# EAGLE board draft5_4lyr_autoroute (EAGLE 6.3)
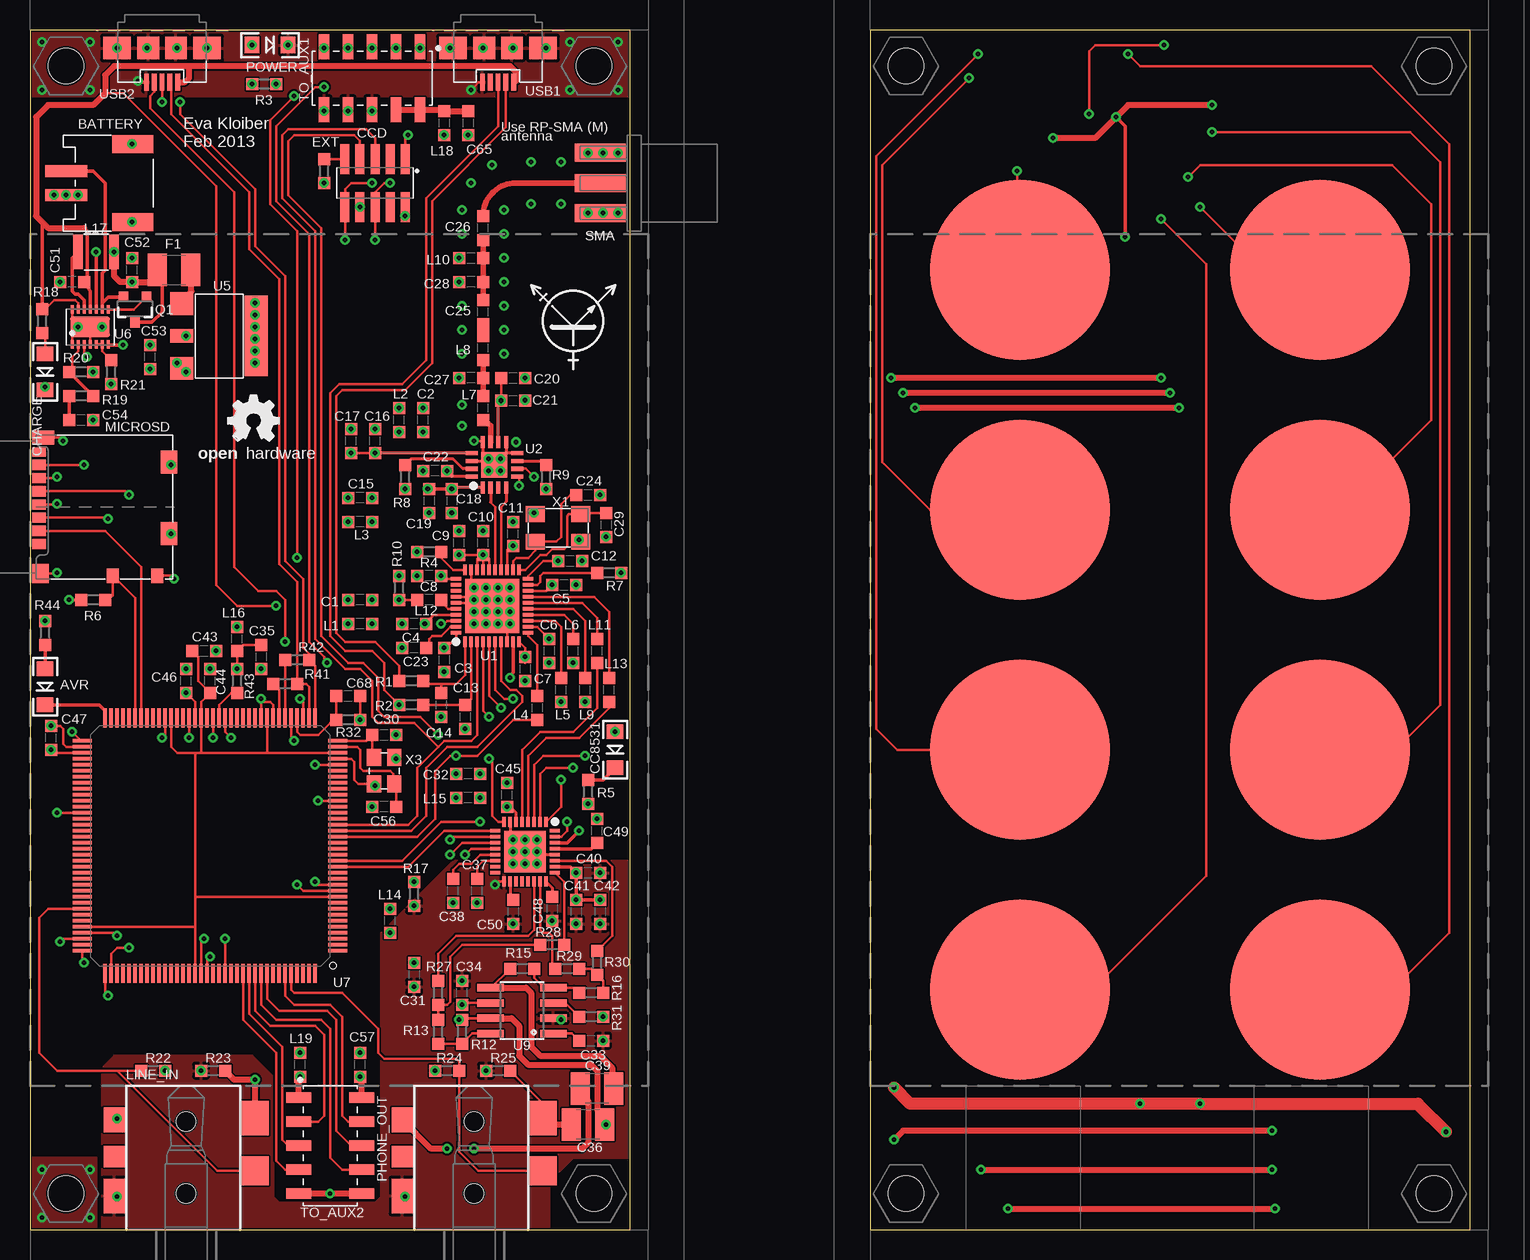
[diagram p2: board, top side]
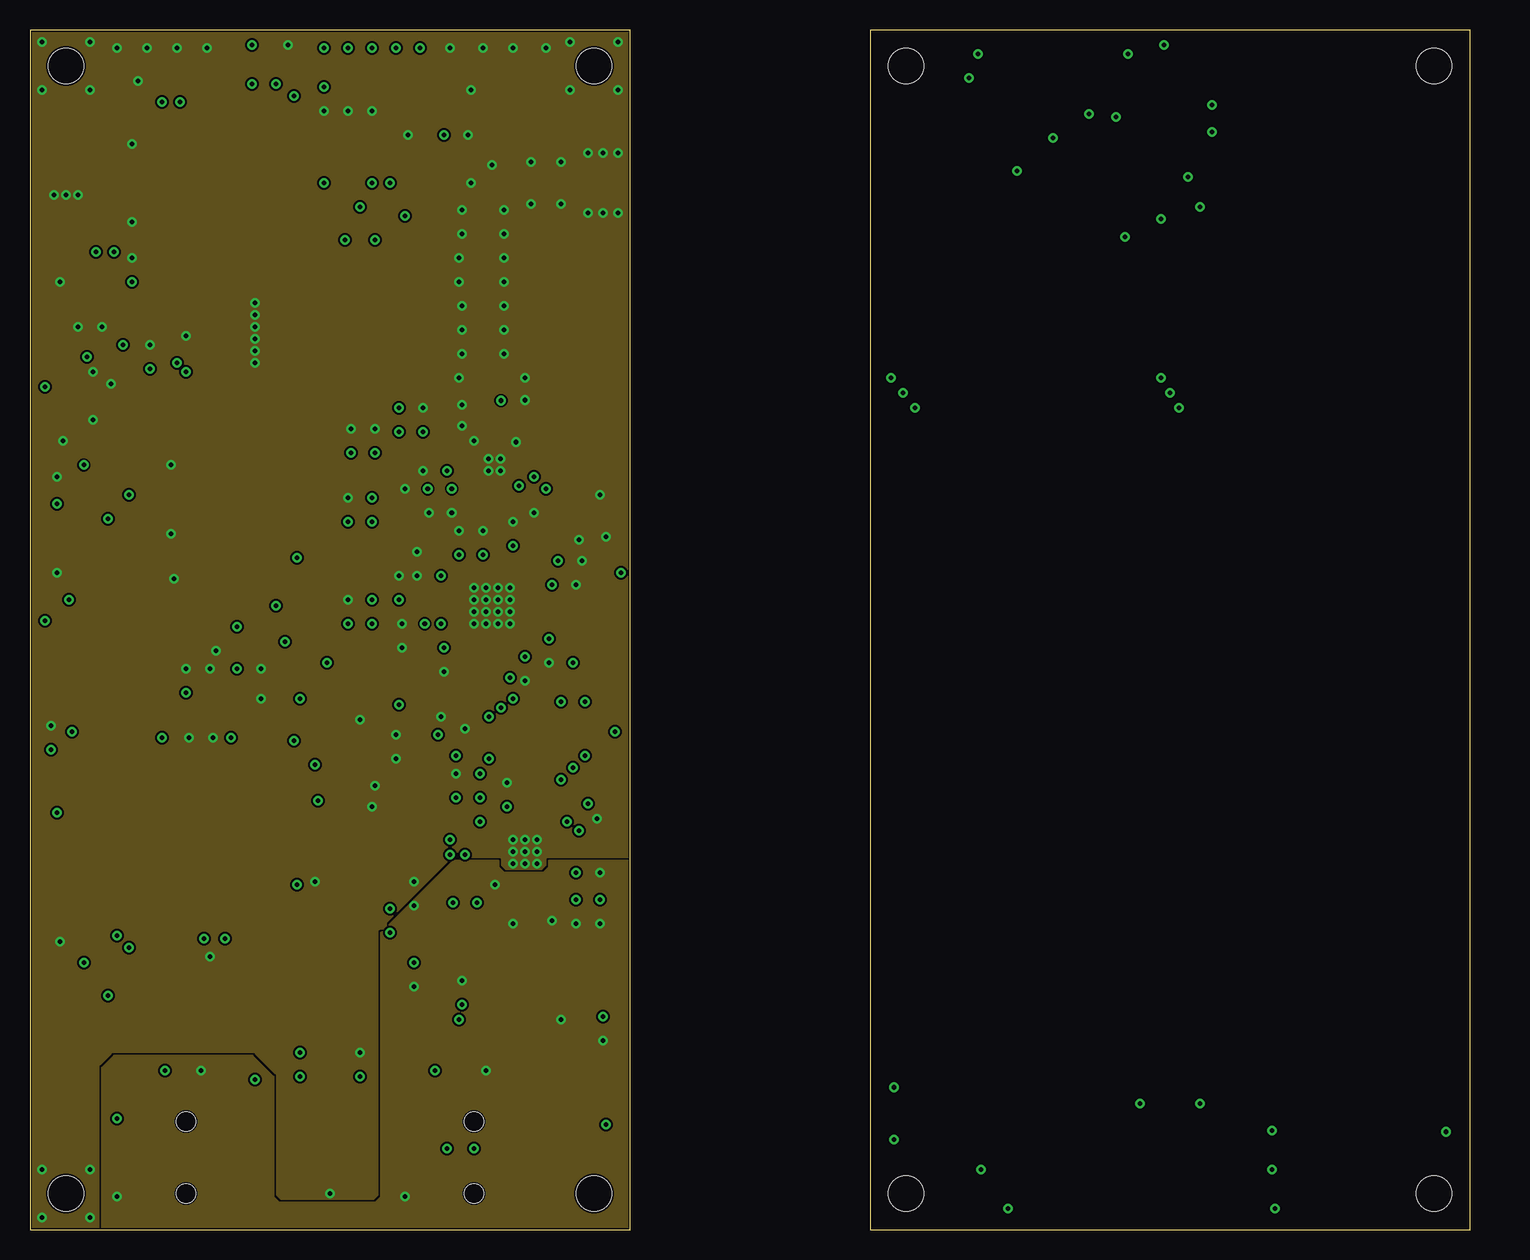
[diagram p3: board, inner layer Route2]
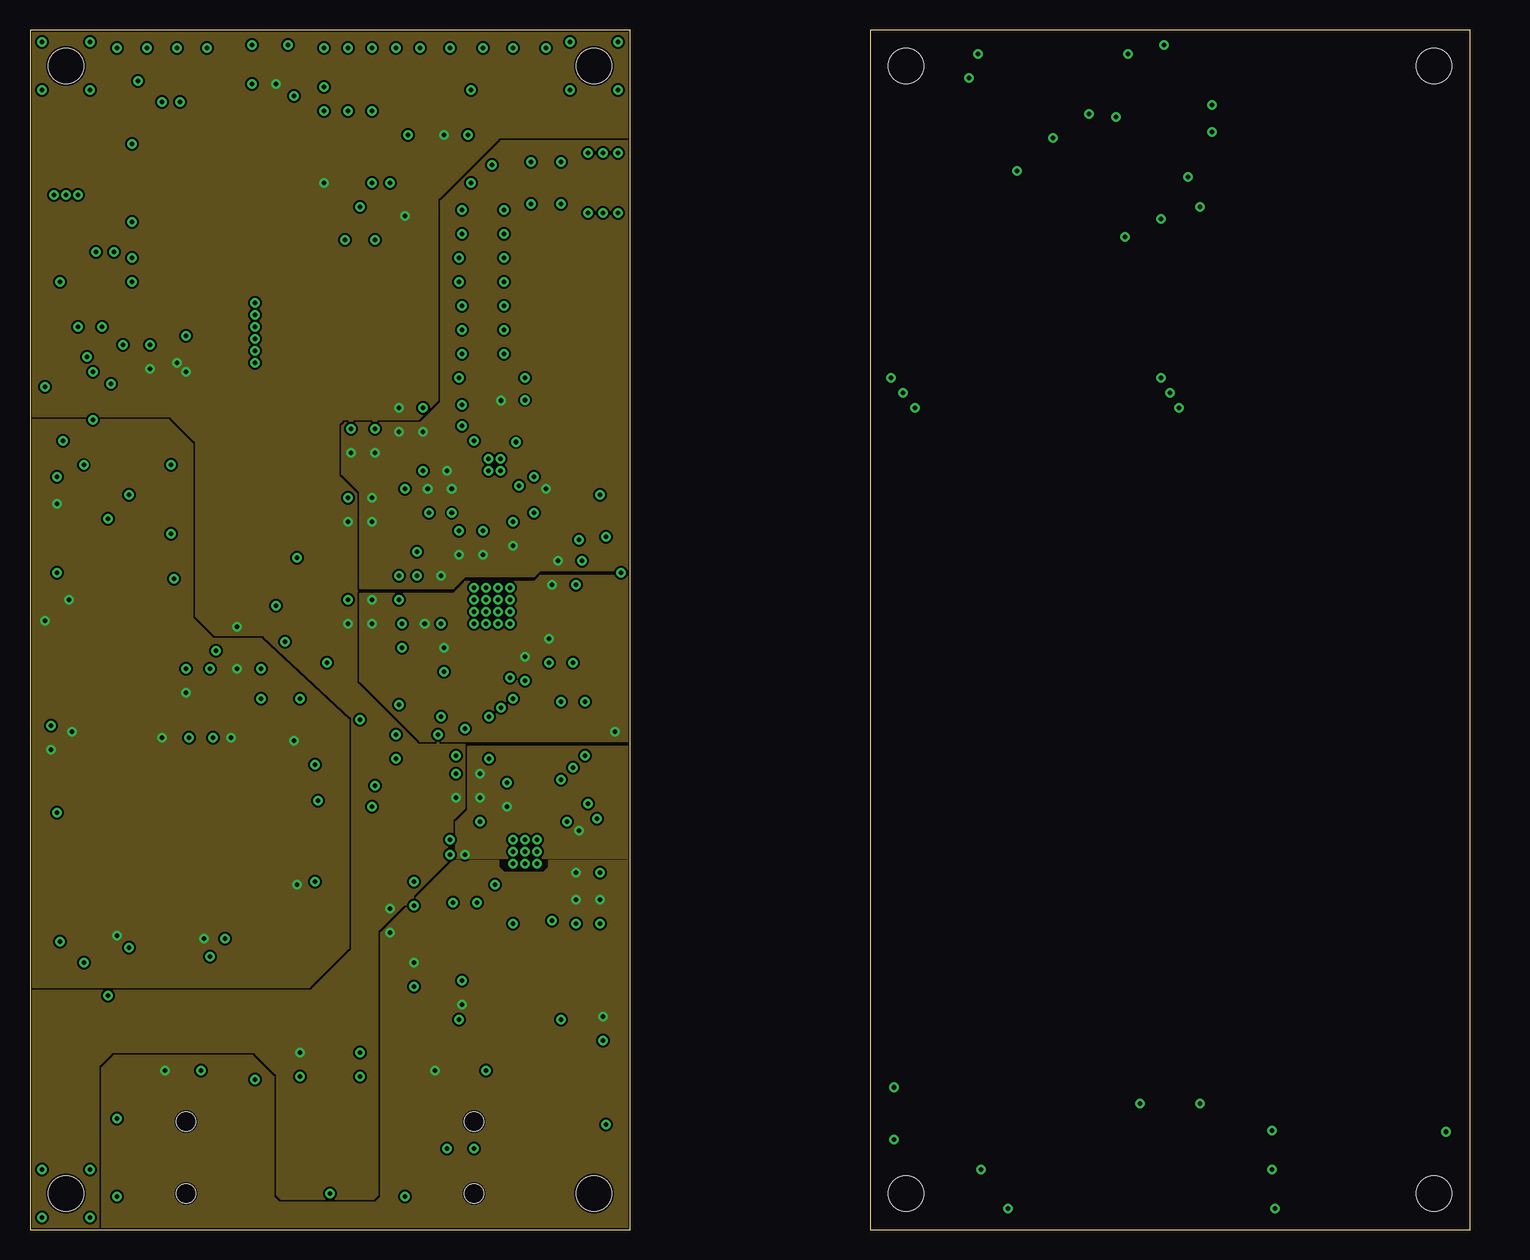
[diagram p4: board, inner layer Route3]
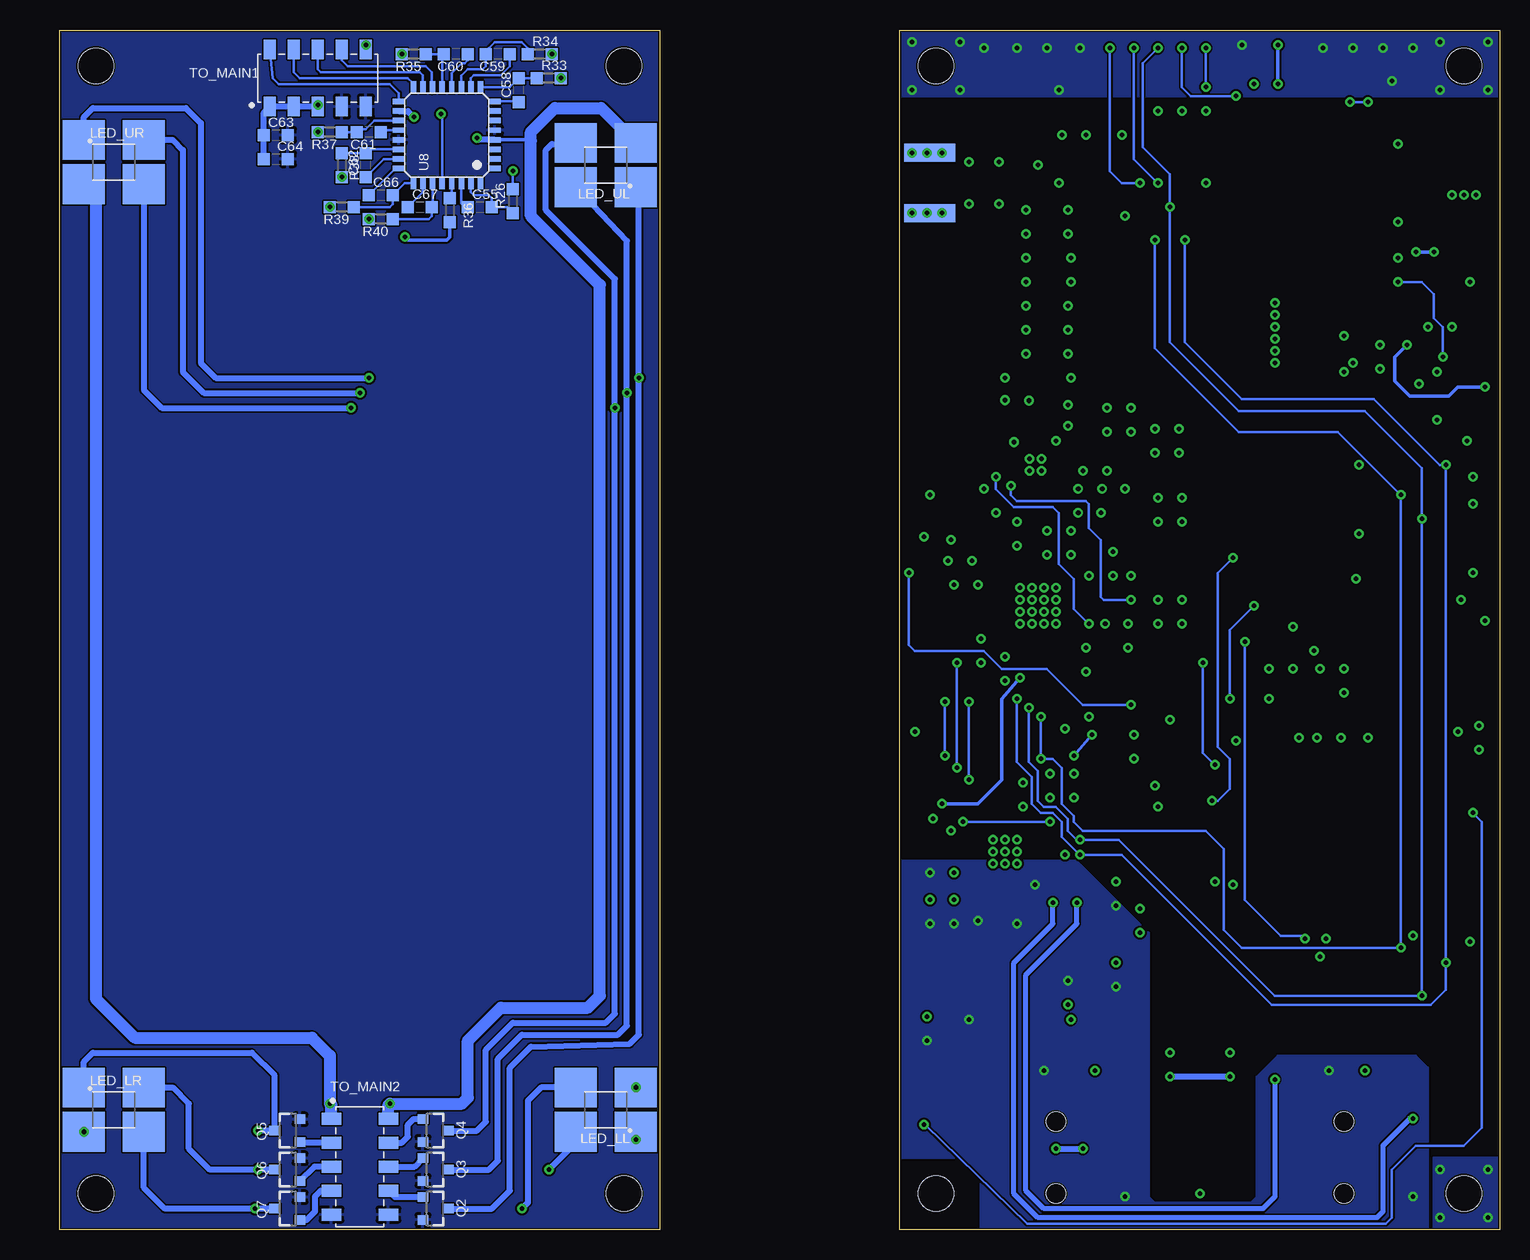
[diagram p5: board, bottom side, seen from below]

Size 120 x 100 mm. Coordinates in mm from the lower left corner, seen from the top.
Outline: 0,0 50,0 50,100 0,100 0,0
Outline: 70,0 120,0 120,100 70,100 70,0
Copper layers (1+2*3+16): Top 0.034290625mm / dielectric 0.24891875mm / Route2 0.034290625mm / dielectric 39mil / Route3 0.034290625mm / dielectric 0.24891875mm / Bottom 0.034290625mm
Design rules "66each": minimum track width 6mil, minimum drill 15mil, track to track 6mil, track to pad 6mil, pad to pad 6mil, via to via 6mil, smd to smd 0mil, copper to edge 6mil, drill to drill 6mil, minimum pad ring 10mil, minimum via ring 8mil, stop-mask expansion 4mil, vias tented up to drill 0mil, thermal gap 10mil
tRestrict: area 38.8,66.5 to 39.5,68.5; area 37.5,66.2 to 38.8,67; area 29.2,64.2 to 36.2,65.2; area 35.5,61.2 to 37.8,62.2; area 38,55 to 40,61.8; area 36.8,66.5 to 50,88.2

## Footprints (pad centres in the part's own frame; a part is rotated, then mirrored left to right if it is on the bottom)
LED-1206 = smd 1.2 x 1.4: A -1.5,0; C 1.5,0
1775469-2 = smd 1 x 3.5: + -1,-1.75; - 1,-1.75 | smd 1.5 x 3.4: X1 -3.25,3.8; X2 3.25,3.8
C0603 = smd 1 x 1: 1 -1,0; 2 1,0
C1210 = smd 1.6 x 2.7: 1 -1.4,0; 2 1.4,0
HEADER-10P-1.27MM = smd 0.75 x 2.5: 1 -2.54,-2; 2 -2.54,2; 3 -1.27,-2; 4 -1.27,2; 5 0,-2; 6 0,2; 7 1.27,-2; 8 1.27,2; 9 2.54,-2; 10 2.54,2
R0603 = smd 1 x 1: 1 -1,0; 2 1,0
1210 = smd 1.6 x 2.7: 1 -1.4,0; 2 1.4,0
0603 = smd 1 x 1: 1 -1,0; 2 1,0
IFSC-1111AB-01 = smd 0.8 x 2.9: 1 -1.5,0; 2 1.5,0
PLCC-4 = smd 1.5 x 1.1: 1 -1.5,0.75; 2 -1.5,-0.75; 3 1.5,-0.75; 4 1.5,0.75 | smd 3.5 x 3.3: 1-2 -2.5,1.85; 2-2 -2.5,-1.85; 3-2 2.5,-1.85; 4-2 2.5,1.85
STX-35332-5N = smd 1.75 x 2.1: 1 -6,9.15 | smd 1.75 x 1.8: 2 -6,6.1 | smd 2.25 x 2.4: 3 5.75,4.9 | smd 2.25 x 2.9: 4 5.75,9.3 | smd 1.75 x 2.9: 5 -6,2.8 | hole 1.6: 0,9; 0,3
MOLEX_104031-0811 = smd 0.85 x 1.1: CD/DAT3 2.005,0.25; CLK -1.295,0.25; CMD 0.905,0.25; DAT0 -3.495,0.25; DAT2 3.105,0.25; VDD -0.195,0.25; VSS -2.395,0.25 | smd 0.75 x 1.1: DAT1 -4.545,0.25 | smd 1.55 x 1.35: GND1 5.565,0.375 | smd 1.17 x 1.8: GND2 -5.755,0.6 | smd 1.9 x 1.35: GND3 -3.73,11.075; GND4 2.24,11.075 | smd 1.2 x 1: SWA 5.74,6.4; SWB 5.74,10.1
SOT23-3 = smd 0.8 x 0.9: 1 -0.95,-1; 2 0.95,-1; 3 0,1.1
CONREVSMA003.062 = smd 4.25 x 1.5 bottom: GND1 2.25,-2.54; GND3 2.25,2.54 | smd 4.25 x 1.5: GND2 2.25,-2.54; GND4 2.25,2.54; SIG 2.25,0
TOUCH-CIRCLE-15MM = smd 15 x 15: P$1 0,0
M22-63405 = smd 0.89 x 2.1: 1 -4,-2.6; 2 -4,2.65; 3 -2,-2.6; 4 -2,2.65; 5 0,-2.6; 6 0,2.65; 7 2,-2.6; 8 2,2.65; 9 4,-2.6; 10 4,2.65
M22-53205 = smd 1 x 1.65: 1 -4,-2.375; 2 -4,2.375; 3 -2,-2.375; 4 -2,2.375; 5 0,-2.375; 6 0,2.375; 7 2,-2.375; 8 2,2.375; 9 4,-2.375; 10 4,2.375
S-PVQFN-N40 = smd 0.85 x 0.28: 1 -3,2.25; 2 -3,1.75; 3 -3,1.25; 4 -3,0.75; 5 -3,0.25; 6 -3,-0.25; 7 -3,-0.75; 8 -3,-1.25; 9 -3,-1.75; 10 -3,-2.25; 21 3,-2.25; 22 3,-1.75; 23 3,-1.25; 24 3,-0.75; 25 3,-0.25; 26 3,0.25; 27 3,0.75; 28 3,1.25; 29 3,1.75; 30 3,2.25 | smd 0.28 x 0.85: 11 -2.25,-3; 12 -1.75,-3; 13 -1.25,-3; 14 -0.75,-3; 15 -0.25,-3; 16 0.25,-3; 17 0.75,-3; 18 1.25,-3; 19 1.75,-3; 20 2.25,-3; 31 2.25,3; 32 1.75,3; 33 1.25,3; 34 0.75,3; 35 0.25,3; 36 -0.25,3; 37 -0.75,3; 38 -1.25,3; 39 -1.75,3; 40 -2.25,3 | smd 4.5 x 4.5: GND 0,0
S-PVQFN-N16 = smd 1 x 0.35: 1 -1.9,0.975; 2 -1.9,0.325; 3 -1.9,-0.325; 4 -1.9,-0.975; 9 1.9,-0.975; 10 1.9,-0.325; 11 1.9,0.325; 12 1.9,0.975 | smd 0.35 x 1: 5 -0.975,-1.9; 6 -0.325,-1.9; 7 0.325,-1.9; 8 0.975,-1.9; 13 0.975,1.9; 14 0.325,1.9; 15 -0.325,1.9; 16 -0.975,1.9 | smd 2.16 x 2.16: GND 0,0
S-PVQFN-N32 = smd 0.85 x 0.28: 1 -2.475,1.75; 2 -2.475,1.25; 3 -2.475,0.75; 4 -2.475,0.25; 5 -2.475,-0.25; 6 -2.475,-0.75; 7 -2.475,-1.25; 8 -2.475,-1.75; 17 2.475,-1.75; 18 2.475,-1.25; 19 2.475,-0.75; 20 2.475,-0.25; 21 2.475,0.25; 22 2.475,0.75; 23 2.475,1.25; 24 2.475,1.75 | smd 0.28 x 0.85: 9 -1.75,-2.475; 10 -1.25,-2.475; 11 -0.75,-2.475; 12 -0.25,-2.475; 13 0.25,-2.475; 14 0.75,-2.475; 15 1.25,-2.475; 16 1.75,-2.475; 25 1.75,2.475; 26 1.25,2.475; 27 0.75,2.475; 28 0.25,2.475; 29 -0.25,2.475; 30 -0.75,2.475; 31 -1.25,2.475; 32 -1.75,2.475 | smd 3.45 x 3.45: GND 0,0
SOT-223 = smd 1.9 x 1.9: 1 -2.7,-3.1; 3 2.7,-3.1 | smd 1.1 x 1.9: 2 0,-3.1 | smd 6.7 x 1.9: 4 0,3.1
DFN-14 = smd 0.25 x 0.7: 1 -1.5,-1.45; 2 -1,-1.45; 3 -0.5,-1.45; 4 0,-1.45; 5 0.5,-1.45; 6 1,-1.45; 7 1.5,-1.45; 8 1.5,1.45; 9 1,1.45; 10 0.5,1.45; 11 0,1.45; 12 -0.5,1.45; 13 -1,1.45; 14 -1.5,1.45 | smd 3.3 x 1.7: GND 0,0
LQFP-144 = smd 1.6 x 0.3: 1 -10.65,8.75; 2 -10.65,8.25; 3 -10.65,7.75; 4 -10.65,7.25; 5 -10.65,6.75; 6 -10.65,6.25; 7 -10.65,5.75; 8 -10.65,5.25; 9 -10.65,4.75; 10 -10.65,4.25; 11 -10.65,3.75; 12 -10.65,3.25; 13 -10.65,2.75; 14 -10.65,2.25; 15 -10.65,1.75; 16 -10.65,1.25; 17 -10.65,0.75; 18 -10.65,0.25; 19 -10.65,-0.25; 20 -10.65,-0.75; 21 -10.65,-1.25; 22 -10.65,-1.75; 23 -10.65,-2.25; 24 -10.65,-2.75; 25 -10.65,-3.25; 26 -10.65,-3.75; 27 -10.65,-4.25; 28 -10.65,-4.75; 29 -10.65,-5.25; 30 -10.65,-5.75; 31 -10.65,-6.25; 32 -10.65,-6.75; 33 -10.65,-7.25; 34 -10.65,-7.75; 35 -10.65,-8.25; 36 -10.65,-8.75; 73 10.65,-8.75; 74 10.65,-8.25; 75 10.65,-7.75; 76 10.65,-7.25; 77 10.65,-6.75; 78 10.65,-6.25; 79 10.65,-5.75; 80 10.65,-5.25; 81 10.65,-4.75; 82 10.65,-4.25; 83 10.65,-3.75; 84 10.65,-3.25; 85 10.65,-2.75; 86 10.65,-2.25; 87 10.65,-1.75; 88 10.65,-1.25; 89 10.65,-0.75; 90 10.65,-0.25; 91 10.65,0.25; 92 10.65,0.75; 93 10.65,1.25; 94 10.65,1.75; 95 10.65,2.25; 96 10.65,2.75; 97 10.65,3.25; 98 10.65,3.75; 99 10.65,4.25; 100 10.65,4.75; 101 10.65,5.25; 102 10.65,5.75; 103 10.65,6.25; 104 10.65,6.75; 105 10.65,7.25; 106 10.65,7.75; 107 10.65,8.25; 108 10.65,8.75 | smd 0.3 x 1.6: 37 -8.75,-10.65; 38 -8.25,-10.65; 39 -7.75,-10.65; 40 -7.25,-10.65; 41 -6.75,-10.65; 42 -6.25,-10.65; 43 -5.75,-10.65; 44 -5.25,-10.65; 45 -4.75,-10.65; 46 -4.25,-10.65; 47 -3.75,-10.65; 48 -3.25,-10.65; 49 -2.75,-10.65; 50 -2.25,-10.65; 51 -1.75,-10.65; 52 -1.25,-10.65; 53 -0.75,-10.65; 54 -0.25,-10.65; 55 0.25,-10.65; 56 0.75,-10.65; 57 1.25,-10.65; 58 1.75,-10.65; 59 2.25,-10.65; 60 2.75,-10.65; 61 3.25,-10.65; 62 3.75,-10.65; 63 4.25,-10.65; 64 4.75,-10.65; 65 5.25,-10.65; 66 5.75,-10.65; 67 6.25,-10.65; 68 6.75,-10.65; 69 7.25,-10.65; 70 7.75,-10.65; 71 8.25,-10.65; 72 8.75,-10.65; 109 8.75,10.65; 110 8.25,10.65; 111 7.75,10.65; 112 7.25,10.65; 113 6.75,10.65; 114 6.25,10.65; 115 5.75,10.65; 116 5.25,10.65; 117 4.75,10.65; 118 4.25,10.65; 119 3.75,10.65; 120 3.25,10.65; 121 2.75,10.65; 122 2.25,10.65; 123 1.75,10.65; 124 1.25,10.65; 125 0.75,10.65; 126 0.25,10.65; 127 -0.25,10.65; 128 -0.75,10.65; 129 -1.25,10.65; 130 -1.75,10.65; 131 -2.25,10.65; 132 -2.75,10.65; 133 -3.25,10.65; 134 -3.75,10.65; 135 -4.25,10.65; 136 -4.75,10.65; 137 -5.25,10.65; 138 -5.75,10.65; 139 -6.25,10.65; 140 -6.75,10.65; 141 -7.25,10.65; 142 -7.75,10.65; 143 -8.25,10.65; 144 -8.75,10.65
S-PQFP-N32 = smd 0.45 x 1: 1 -2.8,-4; 2 -2,-4; 3 -1.2,-4; 4 -0.4,-4; 5 0.4,-4; 6 1.2,-4; 7 2,-4; 8 2.8,-4; 17 2.8,4; 18 2,4; 19 1.2,4; 20 0.4,4; 21 -0.4,4; 22 -1.2,4; 23 -2,4; 24 -2.8,4 | smd 1 x 0.45: 9 4,-2.8; 10 4,-2; 11 4,-1.2; 12 4,-0.4; 13 4,0.4; 14 4,1.2; 15 4,2; 16 4,2.8; 25 -4,2.8; 26 -4,2; 27 -4,1.2; 28 -4,0.4; 29 -4,-0.4; 30 -4,-1.2; 31 -4,-2; 32 -4,-2.8
SO08 = smd 0.61 x 2.21: 1 -1.905,-2.616; 2 -0.635,-2.616; 3 0.635,-2.616; 4 1.905,-2.616; 5 1.905,2.616; 6 0.635,2.616; 7 -0.635,2.616; 8 -1.905,2.616
STANDOFF_3/16 = hole 2.946: 0,0
USB_MICRO_AB = smd 0.4 x 1.4: 1 -1.3,2.85; 2 -0.65,2.85; 3 0,2.85; 4 0.65,2.85; 5 1.3,2.85 | smd 2.3 x 1.9: GND1 -3.75,0; GND4 3.75,0 | smd 1.8 x 1.9: GND2 -1.15,0; GND3 1.15,0
ABM3C = smd 1.6 x 1.3: 1 -1.9,-1.15; 2 1.9,-1.15; 3 1.9,1.15; 4 -1.9,1.15
ABM8G = smd 1.4 x 1.2: GND-1 -1.1,0.85; GND-2 1.1,-0.85; X1 1.1,0.85; X2 -1.1,-0.85

## Placement (x,y rotation side)
AVR  [LED-1206]  1.25,45.25 270 top
BATTERY  BATTERY-LIPO-JST  [1775469-2]  4.75,87.25 270 top
C1  2.2u  [C0603]  27.5,52.5 180 top
C2  2.2u  [C0603]  32.75,67.5 90 top
C3  1u  [C0603]  34.5,47.5 270 top
C4  100n  [C0603]  32,50.5 180 top
C5  100n  [C0603]  44.5,53.75 0 top
C6  100n  [C0603]  43.25,48.25 270 top
C7  100n  [C0603]  41.25,46.75 270 top
C8  100n  [C0603]  33.25,54.5 180 top
C9  100n  [C0603]  35.75,57.25 90 top
C10  220p  [C0603]  37.75,57.25 90 top
C11  100n  [C0603]  40.25,58 90 top
C12  100n  [C0603]  45,55.75 0 top
C13  47p  [C0603]  36.25,42.75 270 top
C14  47p  [C0603]  34.25,43.75 270 top
C15  2.2u  [C0603]  27.5,61 180 top
C16  10p  [C0603]  28.75,65.75 90 top
C17  1n  [C0603]  26.75,65.75 90 top
C18  10p  [C0603]  35.15,60.75 270 top
C19  1n  [C0603]  33.25,60.75 270 top
C20  1n  [C0603]  40.25,71 0 top
C21  18p  [C0603]  40.25,69.1 0 top
C22  1n  [C0603]  33.75,63.25 180 top
C23  1u  [C0603]  32,48.5 180 top
C24  15p  [C0603]  46.5,61.25 0 top
C25  6.8p_HF  [C0603]  37.75,76.5 90 top
C26  100p_HF  [C0603]  37.75,83.5 90 top
C27  1.2p_HF  [C0603]  36.75,71 180 top
C28  1.8p_HF  [C0603]  36.75,79 180 top
C29  15p  [C0603]  48,58.75 270 top
C30  10p  [C0603]  29.5,41.25 0 top
C31  2.2u  [C0603]  32,21.25 270 top
C32  2.2u  [C0603]  36.5,38 180 top
C33  1u  [C0603]  46.75,15.75 0 top
C34  100n  [C0603]  36,19.75 90 top
C35  2.2u  [C0603]  19.25,47.75 270 top
C36  220u  [C1210]  46.5,8.75 180 top
C37  0.47u  [C0603]  37.25,28.25 90 top
C38  0.47u  [C0603]  35.25,28.25 90 top
C39  220u  [C1210]  47.25,11.75 180 top
C40  100n  [C0603]  46.5,29.75 0 top
C41  1u  [C0603]  45.5,26.5 270 top
C42  10u  [C0603]  47.5,26.5 270 top
C43  100n  [C0603]  14.5,48.25 0 top
C44  4.7u  [C0603]  15,45.75 90 top
C45  1u  [C0603]  39.75,36.25 90 top
C46  10u  [C0603]  13,45.75 90 top
C47  100n  [C0603]  1.75,41 90 top
C48  10u  [C0603]  43.5,26.75 270 top
C49  10u  [C0603]  47.25,33.25 90 top
C50  10u  [C0603]  40.25,26.5 270 top
C51  10u  [C0603]  3.5,79 180 top
C52  10u  [C0603]  8.5,80 90 top
C53  10u  [C0603]  10,72.75 90 top
C54  100n  [C0603]  4.25,67.5 0 top
C55  10n  [C0603]  85,85.25 0 bottom
C56  10p  [C0603]  29.5,35.25 180 top
C57  2.2u  [C0603]  27.5,13.75 90 top
C58  10n  [C0603]  81.75,95 90 bottom
C59  10n  [C0603]  83.5,98 180 bottom
C60  10n  [C0603]  87,98 180 bottom
C61  10n  [C0603]  94.25,91.5 180 bottom
C62  10n  [C0603]  94.5,88.75 90 bottom
C63  100n  [C0603]  102,91.25 0 bottom
C64  100n  [C0603]  102,89.25 0 bottom
C65  2.2u  [C0603]  36.5,92.25 270 top
C66  10n  [C0603]  93.25,86.25 0 bottom
C67  10n  [C0603]  90,85.25 0 bottom
C68  10p  [C0603]  26.5,44.5 0 top
CC8531  [LED-1206]  48.75,40 270 top
CCD  HEADER-10P-SMD-MALE2  [HEADER-10P-1.27MM]  28.75,87.25 180 top
CHARGE  [LED-1206]  1.25,71.5 270 top
EXT  0  [R0603]  24.5,88.25 270 top
F1  2A  [1210]  12,80 0 top
L1  BEAD  [0603]  27.5,50.5 180 top
L2  BEAD  [0603]  30.75,67.5 90 top
L3  BEAD  [0603]  27.5,59 180 top
L4  6.8n  [0603]  42.25,43.5 270 top
L5  6.8n  [0603]  44.25,45 90 top
L6  6.8n  [0603]  45.25,48.25 90 top
L7  2.2n_HF  [0603]  37.75,68.5 90 top
L8  3.9n_HF  [0603]  37.75,73.5 90 top
L9  6.8n  [0603]  46.25,45 90 top
L10  1.5n_HF  [0603]  36.75,81 0 top
L11  6.8n  [0603]  47.25,48.25 90 top
L12  6.8n  [0603]  33.25,52.5 180 top
L13  6.8n  [0603]  48.25,45 90 top
L14  BEAD  [0603]  30,25.75 90 top
L15  BEAD  [0603]  36.5,36 180 top
L16  BEAD  [0603]  17.25,49.25 90 top
L17  3.3u  [IFSC-1111AB-01]  5.5,81.5 0 top
L18  BEAD  [0603]  34.5,92.25 270 top
L19  BEAD  [0603]  22.5,13.75 90 top
LED_LL  LED_RGB  [PLCC-4]  74.5,10 180 bottom
LED_LR  LED_RGB  [PLCC-4]  115.5,10 0 bottom
LED_UL  LED_RGB  [PLCC-4]  74.5,88.75 180 bottom
LED_UR  LED_RGB  [PLCC-4]  115.5,89 0 bottom
LINE_IN  PHONE_SW-STX-35332-5N  [STX-35332-5N]  13,0 0 top
MICROSD  MICROSD104031-0811  [MOLEX_104031-0811]  0.5,60.25 270 top
PHONE_OUT  PHONE_SW-STX-35332-5N  [STX-35332-5N]  37,0 0 top
POWER  [LED-1206]  20,98.75 0 top
Q1  Si2333  [SOT23-3]  8.75,76.75 180 top
Q2  2N7002  [SOT23-3]  88.75,1.75 270 bottom
Q3  2N7002  [SOT23-3]  88.75,5 270 bottom
Q4  2N7002  [SOT23-3]  88.75,8.25 270 bottom
Q5  2N7002  [SOT23-3]  101,8.25 90 bottom
Q6  2N7002  [SOT23-3]  101,5 90 bottom
Q7  2N7002  [SOT23-3]  101,1.75 90 bottom
R1  33  [R0603]  31.75,45.75 180 top
R2  33  [R0603]  31.75,43.75 180 top
R3  100  [R0603]  19.5,95.5 0 top
R4  56k  [R0603]  33.25,56.5 0 top
R5  100  [R0603]  46.5,36.5 90 top
R6  100K  [R0603]  5.25,52.5 0 top
R7  1.5K  [R0603]  48.25,54.75 0 top
R8  4.3K  [R0603]  31.25,62.75 90 top
R9  4.3K  [R0603]  43,62.75 270 top
R10  10K  [R0603]  30.75,53.5 270 top
R12  20K  [R0603]  36,16.5 270 top
R13  20K  [R0603]  34,16.5 90 top
R15  20K  [R0603]  41,21.75 0 top
R16  20K  [R0603]  46.75,19.75 0 top
R17  0  [R0603]  32,28 270 top
R18  330  [R0603]  1,75.75 90 top
R19  8.2  [R0603]  4.25,69.5 0 top
R20  2.94K  [R0603]  4.25,71.5 180 top
R21  1K  [R0603]  6.75,71.5 90 top
R22  1M  [R0603]  10.25,13.25 0 top
R23  100K  [R0603]  15.25,13.25 0 top
R24  1M  [R0603]  34.75,13.25 180 top
R25  100K  [R0603]  39,13.25 0 top
R26  4.7K  [R0603]  82.25,85.75 90 bottom
R27  0  [R0603]  34,19.75 270 top
R28  0  [R0603]  43.5,23.75 180 top
R29  0  [R0603]  44.75,21.75 0 top
R30  0  [R0603]  47.25,22.25 270 top
R31  10K  [R0603]  46.75,17.75 0 top
R32  6.8K  [R0603]  26.5,42.5 180 top
R33  4.7K  [R0603]  79.25,96 0 bottom
R34  4.7K  [R0603]  80,98 0 bottom
R35  4.7K  [R0603]  90.5,98 180 bottom
R36  100K  [R0603]  87.5,85 270 bottom
R37  4.7K  [R0603]  97.5,91.5 180 bottom
R38  4.7K  [R0603]  96.5,88.75 270 bottom
R39  4.7K  [R0603]  96.5,85.25 180 bottom
R40  4.7K  [R0603]  93.25,84.25 180 bottom
R41  39  [R0603]  21.25,45.5 0 top
R42  39  [R0603]  22.25,47.5 0 top
R43  100K  [R0603]  17.25,45.75 270 top
R44  100  [R0603]  1.25,49.75 90 top
SMA  SMA-REVSMA-0.62  [CONREVSMA003.062]  49.75,87.25 180 top
SW1  TOUCH_PAD-CIRCLE-15MM  [TOUCH-CIRCLE-15MM]  82.5,80 0 top
SW4  TOUCH_PAD-CIRCLE-15MM  [TOUCH-CIRCLE-15MM]  82.5,60 0 top
SW5  TOUCH_PAD-CIRCLE-15MM  [TOUCH-CIRCLE-15MM]  82.5,40 0 top
SW6  TOUCH_PAD-CIRCLE-15MM  [TOUCH-CIRCLE-15MM]  107.5,20 0 top
SW7  TOUCH_PAD-CIRCLE-15MM  [TOUCH-CIRCLE-15MM]  107.5,40 0 top
SW8  TOUCH_PAD-CIRCLE-15MM  [TOUCH-CIRCLE-15MM]  107.5,60 0 top
SW9  TOUCH_PAD-CIRCLE-15MM  [TOUCH-CIRCLE-15MM]  107.5,80 0 top
SW10  TOUCH_PAD-CIRCLE-15MM  [TOUCH-CIRCLE-15MM]  82.5,20 0 top
TO_AUX1  HEADER-10P-SMD-2MM-FEMALE  [M22-63405]  28.5,96 180 top
TO_AUX2  HEADER-10P-SMD-2MM-FEMALE  [M22-63405]  25,7 270 top
TO_MAIN1  HEADER-10P-SMD-2MM-MALE  [M22-53205]  98.5,96 0 bottom
TO_MAIN2  HEADER-10P-SMD-2MM-MALE  [M22-53205]  95,5.25 270 bottom
U1  CC8531  [S-PVQFN-N40]  38.5,52 90 top
U2  CC2591  [S-PVQFN-N16]  38.7,63.75 90 top
U3  TLV320AIC3204  [S-PVQFN-N32]  41.25,31.5 270 top
U5  [SOT-223]  15.75,74.5 270 top
U6  LTC4088-2  [DFN-14]  5,75.25 0 top
U7  ATSAM3X8E_ALT-LQFP-144  [LQFP-144]  15,32 180 top
U8  AT42QT1110-TQFP  [S-PQFP-N32]  87.75,91.25 90 bottom
U9  LM4881  [SO08]  41,18.25 90 top
U$1  [STANDOFF_3/16]  47,97 90 top
U$2  [PHONE_PLUG]  37,-3 270 top
U$3  [PHONE_PLUG]  13,-3 270 top
U$4  [UBBP01]  0,12 0 top
U$5  [STANDOFF_3/16]  73,97 270 top
U$6  [STANDOFF_3/16]  3,3 270 top
U$7  [STANDOFF_3/16]  3,97 90 top
U$8  [STANDOFF_3/16]  47,3 90 top
U$9  [TRANS_SILK]  45.25,75.75 0 top
U$10  [OSHW_FILLX150_NOTEXT]  16.5,65.75 0 top
U$11  [STANDOFF_3/16]  117,97 90 top
U$12  [STANDOFF_3/16]  73,3 270 top
U$13  [STANDOFF_3/16]  117,3 270 top
U$14  [UBBP01]  70,12 0 top
USB1  USB_MICRO_AB  [USB_MICRO_AB]  39,98.5 180 top
USB2  USB_MICRO_AB  [USB_MICRO_AB]  11,98.5 180 top
X1  48MHz  [ABM3C]  44,58.5 180 top
X3  12MHz  [ABM8G]  29.5,38.25 270 top

## Tracks (layer width: path | path; a pad name or v marks a point on that pad's centre or on a via)
3.3V  (via drill 0.38, 0.4)
  Top 0.2: CCD.2 31.29,84.54 v31.25,84.5 | U5.3 12.7,71.8 v13,71.5
  other vias: 26.5,50.5 30.75,68.5 26.5,59 30,26.75 35.5,36 34.5,91.25 24.5,87.25 20.5,95.5 10,71.75 17.25,50.25 12.25,72.25 22.5,14.75
  pour Route3 (rank 2): 0,100 50,100 50,0 0,0
!AVR_LED
  Top 0.3: U7.72 6.25,43.25 5.75,43.75 AVR.C
!CHANGE  (via drill 0.38)
  Top 0.2: TO_AUX1.9 v24.5,98.5 | 24.5,95 v24.5,95.25 23.75,95.25 20.5,92 20.5,85.75 23.25,83 23.25,49 24.5,47.75 24.5,47.5 v24.75,47.25 | v23.75,38.75 U7.32
  Bottom 0.2: v24.5,98.5 v24.5,95.25 | v24.75,47.25 24.75,39.75 v23.75,38.75
!PAIR
  Top 0.2: U7.21 31.75,33.25 33,34.5 33,38.5 34.75,40.25 37.25,40.25 41,44 41,44.5 40.5,45 40,45 39.25,45.75 U1.7
!SD_CARD
  Top 0.2: U7.67 8.75,52.66 MICROSD.SWA 6.9,52.85 R6.2
AGND  (via drill 0.38, 0.4)
  Top 0.2: U3.17 39.02,29.02 v38.75,28.75 | LINE_IN.5 7.2,2.8 v7.25,2.75 | PHONE_OUT.5 31.45,2.8 v31.25,2.75 | U9.2 44.13,17.61 v44.25,17.5
  Top 0.254: U3.17 39.52,29.02
  other vias: 32,27 36,20.75 14.25,13.25 38,13.25 47.75,15.75 47.5,29.75 47.5,25.5 45.5,25.5 43.5,25.75 32,20.25 40.25,25.5
  pour Route2: 50,30.75 43.25,30.75 43.25,30.25 42.75,29.75 39.5,29.75 39,30.25 39,30.75 35.25,30.75 29.25,24.75 29.25,2.75 28.75,2.25 20.75,2.25 20.25,2.75 20.25,12.75 18.5,14.5 7,14.5 6,13.5 6,0 50,0
  pour Top: 6,0 6,13.5 7,14.5 18.5,14.5 20.25,12.75 20.25,2.75 20.75,2.25 28.75,2.25 29.25,2.75 29.25,24.75 35.25,30.75 38.5,30.75 39.5,29.75 42.75,29.75 43.25,30.25 43.25,30.75 50,30.75 50,6 45.25,6 43.25,4 43.25,0
  pour Bottom: 6,0 6,13.5 7,14.5 18.5,14.5 20.25,12.75 20.25,2.75 20.75,2.25 28.75,2.25 29.25,2.75 29.25,24.75 35.25,30.75 50,30.75 50,6 45.25,6 43.25,4 43.25,0
AUDIO  (via drill 0.38, 0.4)
  Top 0.2: U9.7 36.12,17.61 R12.1 v35.75,17.5 | v2.25,34.75 U7.85 | v48,8.75 47.75,9.25
  Top 0.5: U9.7 40.13,17.61 40.75,17 40.75,14.5 41.5,13.75 46.75,13.75 47.25,13.25 47.25,10 47.75,9.5 47.75,9.25 47.75,8.9 C36.1 48.25,8.4
  Bottom 0.2: v2.25,34.75 1.5,34 1.5,8.5 3,7 7,7 9,5 9,1 9.5,0.5 39.4,0.5 C36.1 v48,8.75
AUX_!CHANGE  (via drill 0.4)
  Top 0.2: v88.25,93 88.25,98.25 88.75,98.75 v94.5,98.75
  Bottom 0.2: U8.28 88.15,92.9 v88.25,93 | TO_MAIN1.10 v94.5,98.75
AUX_BLUE_BOT
  Bottom 0.5: TO_MAIN2.7 98.25,3.25 98.75,2.75 98.75,1.5 99.45,0.8 Q7.1
AUX_BLUE_TOP
  Bottom 0.5: TO_MAIN2.4 91.5,7.25 91,7.75 91,8.75 90.55,9.2 Q4.1
AUX_CS
  Bottom 0.2: U8.14 89,94.8 89,96.5 89.5,97 96,97 96.5,97.5 TO_MAIN1.8
AUX_GREEN_BOT
  Bottom 0.5: TO_MAIN2.5 98.8,5.25 Q6.1
AUX_GREEN_TOP
  Bottom 0.5: TO_MAIN2.6 90.45,5.25 Q3.1
AUX_MISO
  Bottom 0.2: U8.16 90.55,95.55 91,96 100,96 100.5,96.5 TO_MAIN1.4
AUX_MOSI
  Bottom 0.2: U8.15 89.75,96.25 90,96.5 98.25,96.5 98.5,96.75 TO_MAIN1.6
AUX_RED_BOT
  Bottom 0.5: TO_MAIN2.3 99.95,7.25 Q5.1
AUX_RED_TOP
  Bottom 0.5: Q2.1 92.08,2.7 TO_MAIN2.8
AUX_SCLK
  Bottom 0.2: U8.17 91.75,94.75 92.5,95.5 101.75,95.5 102.25,96 TO_MAIN1.2
AUX_VDD  (via drill 0.38, 0.4)
  Top 0.3: v91.25,82.75 91.25,92 v90.5,92.75
  Top 0.5: v85.25,91 88.75,91 v90.5,92.75 91.5,93.75 v98.5,93.75
  Top 1: LED_LL.2-2 73.35,10.5 v92.5,10.5 v97.5,10.5 115.65,10.5 LED_LR.2-2
  Bottom 0.3: R36.2 87.5,82.75 87.75,82.5 91,82.5 v91.25,82.75 | 80.85,90.85 U8.4
  Bottom 0.5: LED_UR.2-2 118,87.25 LED_UR.2 | LED_LR.2 117,9.15 LED_LR.2-2 | LED_LL.2 73,10.85 LED_LL.2-2 | 72,90.5 LED_UL.2-2 73,89.6 LED_UL.2 | U8.18 91,93.25 v90.5,92.75 | U8.4 85.1,90.85 v85.25,91 | C64.1 C63.1 103,93.12 TO_MAIN1.1 TO_MAIN1.3 TO_MAIN1.5 v98.5,93.75 | 80.85,90.85 80.75,90.75
  Bottom 1: TO_MAIN2.2 92.62,10.38 v92.5,10.5 86.5,10.5 86,11 86,15.75 83.25,18.5 76,18.5 75,19.5 75,78.75 80.75,84.5 80.75,90.75 80.75,91.5 78.75,93.5 74.9,93.5 LED_UL.2-2 | LED_LL.2-2 72,11.5 71.75,11.25 | LED_LR.2-2 118.65,8.15 119,8.5 | LED_UR.2 117,19.25 113.75,16 99,16 97.5,14.5 v97.5,10.5 97.38,10.38 TO_MAIN2.1
  other vias: 72,11.85 118,8.15
AUX_VSS
  pour Bottom: 70,100 120,100 120,0 70,0
AVDD  (via drill 0.4)
  Top 0.2: U1.31 34.35,54.25 C8.1 | U1.20 41.5,54.5 42.75,55.75 C12.1 44.1,55.75 | U1.23 39.75,56.65 C11.1 | U1.27 37.75,56.15 | 37.75,56.15 C10.1 | U1.28 37.25,55.9 C10.1 | U1.26 38.25,55.9 C10.1 | C10.1 37.75,56.5 | C9.1 37.65,56.25 37.75,56.15 | C20.1 C21.1 39,69.1 | C17.1 C16.1 | C18.1 35.3,61.75 35.4,61.85
  Top 0.254: U2.1 35.4,61.85 | U2.13 28.93,64.72 C16.1 28.85,64.9 29,64.75 | U2.10 39,65.65 39,69.1 | U2.16 35.08,62.77 C22.1 34.65,63.25
  Top 0.3: C19.1 C18.1
  other vias: 32.75,66.5 30.75,66.5 34.25,54.5 44,55.75 40.25,57 35.75,56.25 37.75,56.25 28.5,59 28.5,61 43,61.75 35.15,61.75 28.75,64.75 39.25,69.1 34.75,63.25 26.75,64.75 33.15,61.75
  pour Route3: 27.5,53.5 35.25,53.5 36.25,54.5 42,54.5 42.5,55 50,55 50,90.75 39.25,90.75 34.25,85.75 34.25,69 32.5,67.25 26.25,67.25 26,67 26,63 27.5,61.5
AVDD_CODEC  (via drill 0.4)
  Top 0.2: U9.6 36.13,18.89 C34.1
  Top 0.3: U3.26 45,30.25 C40.1 C41.1 C42.1
  other vias: 30,24.75 32,22.25 47.5,27.5 45.5,27.5 45.5,29.75 36,18.75 33.75,13.25 47.75,17.75 11.25,13.25
  pour Route3: 50,30.75 43.25,30.75 43.25,30.25 42.75,29.75 39.5,29.75 39,30.25 39,30.75 35.25,30.75 29.25,24.75 29.25,2.75 28.75,2.25 20.75,2.25 20.25,2.75 20.25,12.75 18.5,14.5 7,14.5 6,13.5 6,0 50,0
AVR_PWR  (via drill 0.4)
  Top 0.2: U7.57 13.75,44 C46.1 | U7.75 2,39.75 C47.1 | R43.1 L16.1 17.75,48.75 C35.1 | U7.73 4.25,40.75 v3.5,41.5 | U7.62 11.25,41.25 v11,41 | U7.52 16.25,41.5 v16.75,41 | U7.41 21.75,41 v22,40.75 | U7.11 22.75,28.25 v22.25,28.75 | U7.125 14.25,24 v14.5,24.25 | U7.105 7,24.75 v7.25,24.5 | MICROSD.VDD 2.19,60.45 v2.25,60.5
  Top 0.3: R6.1 v3.25,52.5
  other vias: 1.25,50.75 1.75,40 13,44.75 17.25,46.75
  pour Route3: 0,67.5 0,20.25 23.25,20.25 26.5,23.5 26.5,42.5 19.25,49.25 15.25,49.25 13.5,51 13.5,65.5 11.5,67.5
BAT
  Top 0.3: U6.9 6,77.25 | 6,77.25 6.5,77.75 Q1.2 | 6,77.25 6,79.75 6.25,80 6.25,87.25 5.25,88.25 BATTERY.+
BCLK  (via drill 0.38, 0.4)
  Top 0.2: U3.2 42.5,38 43,38.5 v45.25,38.5
  Bottom 0.2: L6.1 v45.25,38.5
  other vias: 45.25,47.25
BLUE_BOT
  Top 0.2: TO_AUX2.8 26,5 25,6 25,16.75 24.25,17.5 20.5,17.5 19.25,18.75 U7.135
BLUE_TOP
  Top 0.2: TO_AUX2.3 24,9 24.5,9.5 24.5,16.25 23.75,17 20,17 18.75,18.25 U7.134
CS_CC8531
  Top 0.2: U1.3 37.25,41.25 36.75,40.75 34.5,40.75 34,40.25 | U7.22 31.5,33.75 32.25,34.5 32.25,38.5 34,40.25 | CCD.5 28.75,91 28,91.75 21.5,91.75 21,91.25 21,86 23.75,83.25 23.75,49.25 26.25,46.75 27.5,46.75 28.5,45.75 28.5,42.75 29,42.25 32,42.25 34,40.25
CS_CODEC
  Top 0.2: U3.9 34.5,33.25 31.5,30.25 U7.15
CS_SD
  Top 0.2: U7.66 9.25,55.25 6.25,58.25 MICROSD.CD/DAT3
CS_TOUCH  (via drill 0.4)
  Top 0.2: TO_AUX1.7 v26.5,98.5 | v22,94.5 20,92.5 20,85.5 22.25,83.25 v22.25,56 | v24,35.75 U7.26
  Bottom 0.2: v26.5,98.5 26.5,95.25 25.75,94.5 v22,94.5 | v24,35.75 23.5,35.75 22.5,36.75 22.5,39.25 23.5,40.25 23.5,54.75 v22.25,56
D+_CC8531  (via drill 0.38, 0.4)
  Top 0.2: USB1.3 39,92 33,86 33,72.5 31,70.5 25.75,70.5 25,69.75 25,49.5 26.25,48.25 28.5,48.25 29.5,47.25 29.5,45 R2.2
  Bottom 0.2: R7.2 49.25,48.75 48.75,48.25 43,48.25 41.5,46.75 37.75,46.75 34.75,43.75 R2.2
  other vias: 49.25,54.75 30.75,43.75
D+_UC  (via drill 0.38)
  Top 0.2: U7.37 23.75,47 R42.2 23.25,48 22.75,48.5 22.75,54.25 21.25,55.75 21.25,79.5 18.75,82 18.75,86.75 12.5,93 v12.5,94 | USB2.3 v11,94
  Bottom 0.2: v11,94 v12.5,94
D-_CC8531
  Top 0.2: USB1.2 39.65,91.9 33.5,85.75 33.5,72.25 31.25,70 26,70 25.5,69.5 25.5,49.75 26.25,49 28.75,49 30.75,47 R1.2
D-_UC
  Top 0.2: U7.38 23.25,45.25 23,45.5 R41.2 22.25,54 20.75,55.5 20.75,79.25 18.25,81.75 18.25,86.5 11.75,93 11.75,95.55 USB2.2
DIN
  Top 0.2: U3.4 41.5,39.5 43,41 45.75,41 48.25,43.5 L13.1
DOUT
  Top 0.2: U3.5 41,40 42.5,41.5 45.25,41.5 47.25,43.5 L11.1
DVDD
  Top 0.3: U3.29 46.75,31.75 C49.1
DVDD_CODEC  (via drill 0.4)
  Top 0.2: U3.12 36.75,31.75 v36.25,31.25
  Top 0.254: U3.6 40.5,34.75 40.25,35 39.75,35 C45.1
  Top 0.3: U3.30 44.75,32.25 v45.75,33.25
  other vias: 37.5,36 37.5,38 39.75,35.25
  pour Route3: 50,40.25 36.5,40.25 36.5,35 35.5,34 35.5,31 50,31
GND  (via drill 0.38, 0.4)
  Top 0.2: U1.8 39.75,50.75 U1.GND 38.25,52.25 | U1.29 36.75,53.75 v38,52.5 | U1.34 37.75,52.75 v38,52.5 | v38,52.5 38.25,52.25 | U1.35 38.25,52.25 | C21.2 v41.25,69.15 | v37,65.75 37.75,65.75 37.73,65.72 U2.12 | X1.2 42.1,59.6 v42,59.75 | X1.4 v45.75,57.5 | U6.4 U6.GND v4,75.25 3.75,75.25 | U6.1 3.5,75 3.75,75.25 | U6.14 3.5,75.5 3.75,75.25 | U7.126 14.75,22.5 v15,22.75 | U7.106 2.75,24.25 v2.5,24 | U7.12 24,28.75 v23.75,29 | U7.33 26.75,39.25 27,39 27,37.5 27.35,37.15 X3.GND-2 28.65,37.1 v28.75,37 | U7.44 20.25,43.75 20,44 19.5,44 v19.25,44.25 U7.46 | U7.58 v13.25,41 | U7.54 v15.25,41 | U7.74 3,40.25 2.75,40.5 2.75,41.75 2.5,42 C47.2 | v30.5,39.25 30.45,39.25 X3.GND-1 | v18.75,74.25 18.75,74.4 U5.4 | U5.2 v13,74.5 | CCD.1 31.29,91.04 v31.5,91.25 | TO_AUX1.6 28.6,93.35 v28.5,93.25 | TO_AUX1.8 26.6,93.35 v26.5,93.25 | TO_AUX1.10 24.6,93.35 v24.5,93.25 | 41.5,31.25 41.25,31.25 U3.GND | 40,32.75 40.25,32.75 v40.25,32.5 | MICROSD.SWB 11.74,54.51 v12,54.25 | MICROSD.GND4 v11.74,58.01 v11.75,58 | MICROSD.GND3 11.57,63.92 v11.75,63.75 | MICROSD.VSS 2.15,62.65 v2.25,62.75 | MICROSD.GND1 2.19,54.69 v2.25,54.75 | MICROSD.GND2 2.5,66 v2.75,65.75 | USB1.GND4 v35,98.5 | USB1.GND3 v37.75,98.5 | USB1.GND2 v40.25,98.5 | USB1.GND1 v43,98.5 | USB1.5 37.4,95.65 v36.75,95 | v47.75,84.75 SMA.GND4 | v47.75,89.75 SMA.GND1 | C68.2 R32.1
  Top 0.254: U3.28 41.5,31.25 | U3.7 40,32.75 | U2.8 39.67,64.72 | U2.9 39.67,64.72 | 39.67,64.72 U2.GND | U2.12 37.73,64.72 U2.GND | U2.14 38.38,64.08 U2.GND
  Top 0.3: USB2.GND3 v9.75,98.5 | v12.25,98.5 USB2.GND2 | USB2.5 9.1,95.65 v9,95.75 | BATTERY.X1 v8.5,90.5 | 3.75,86.25 v4,86.25 | BATTERY.X2 v8.5,84
  Top 0.5: TO_AUX2.9 v25,3 TO_AUX2.10
  Bottom 0.2: SMA.GND1 v47.75,89.75 | SMA.GND4 v47.75,84.75
  other vias: 40.25,59 37.75,58.25 35.75,58.25 33.25,59.75 35.15,59.75 26.5,61 32.75,68.5 30.75,54.5 26.5,52.5 31.25,61.75 41.25,71 34.5,46.5 31,48.5 41.25,45.75 43.25,47.25 45.5,53.75 46,55.75 40,50.5 39,50.5 38,50.5 37,50.5 37,51.5 38,51.5 39,51.5 40,51.5 40,52.5 39,52.5 37,52.5 37,53.5 38,53.5 39,53.5 40,53.5 40.5,65.65 39.2,63.25 38.2,63.25 38.2,64.25 39.2,64.25 35.75,71 35.75,79 35.75,81 32.75,63.25 28.75,66.75 26.75,66.75 32.25,56.5 32.25,54.5 31,50.5 36.25,41.75 34.25,42.75 42.25,30.5 42.25,31.5 42.25,32.5 41.25,32.5 41.25,30.5 40.25,30.5 40.25,31.5 47.25,34.25 35.5,38 39.75,37.25 32,29 39.5,73 39.5,75 39.5,77 39.5,79 39.5,81 39.5,83 36,83 36,77 36,75 36,73 36,67 36,68.75 5.25,67.5 5.25,71.5 6.75,70.5 39.5,85 36,85 41.75,85.5 44.25,85.5 41.75,89 44.25,89 38.5,88.75 36.75,87.25 28.5,35.25 30.5,41.25 1.75,42 19.25,46.75 15.5,48.25 15,46.75 13,46.75 27.5,42.5 41.25,31.5 48,57.75 47.5,61.25 36.5,91.25 10,73.75 18.75,77.25 18.75,76.25 18.75,75.25 18.75,73.25 18.75,72.25 21.5,98.75 14.75,98.5 7.25,98.5 3,86.25 2,86.25 8.5,81 27.5,14.75 6,75.25 2.5,79 49,89.75 46.5,89.75 49,84.75 46.5,84.75 1,5 5,5 1,1 5,1 5,99 1,99 1,95 5,95 45,99 45,95 49,99 49,95
  pour Route2 (rank 2): 0,100 50,100 50,0 0,0
  pour Top (rank 2): 0,100 50,100 50,94.5 0,94.5
  pour Bottom: 0,100 50,100 50,94.5 0,94.5
  pour Bottom: 0,0 5.5,0 5.5,6 0,6
  pour Top: 0,6 5.5,6 5.5,0 0,0
GREEN_BOT
  Top 0.2: TO_AUX2.6 26.75,7 25.5,8.25 25.5,17.5 24.75,18.25 20.75,18.25 19.75,19.25 U7.136
GREEN_TOP
  Top 0.2: TO_AUX2.5 21.5,7 21,7.5 21,15.25 18.25,18 U7.133
IN_L  (via drill 0.38)
  Top 0.5: LINE_IN.4 v18.75,12.5 17,12.5 R23.2
  Bottom 0.4: v18.75,12.5 18.75,2.75 19.75,1.75 38,1.75 39.5,3.25 39.5,21.25 35.25,25.5 C38.1
  other vias: 35.25,27.25
IN_R  (via drill 0.38)
  Top 0.5: LINE_IN.1 7.15,9.15 v7.25,9.25
  Bottom 0.4: C37.1 37.25,25.5 40.5,22.25 40.5,3 38.5,1 10.25,1 9.75,1.5 9.75,7 7.5,9.25
  Bottom 0.5: v7.25,9.25 7.5,9.25
  other vias: 37.25,27.25
IOVDD  (via drill 0.38, 0.4)
  Top 0.2: U1.10 41.25,48.5 C7.1 41.25,47.25 | U1.37 33.6,51.25 C4.1 v32.9,50.5 | U1.18 43,53.25 43.35,53.6 | 43.35,53.6 C5.1 43.6,53.75 43.35,53.6 | U1.12 42.25,50.25 C6.1 | U1.40 35.5,49.25 C3.1
  other vias: 28.5,50.5 28.5,52.5 41.25,47.75 34.5,48.5 43.5,53.75 43.25,49.25 48.75,41.5
  pour Route3: 50,40.75 50,54.5 42.5,54.5 42,54 36.25,54 35.25,53 27.5,53 27.5,45.75 32.5,40.75
IOVDD1
  Top 0.2: U1.1 36.25,46.25 35.5,45.5 34.25,45.5 | 34.25,45.5 33,45.5 R1.1 | C14.1 34.25,45.5
IOVDD2
  Top 0.2: R2.1 C13.1 36.75,44.25 U1.2
LINE_L
  Top 0.2: U3.22 42,25 41.5,24.5 35.5,24.5 34,23 R27.1
LINE_R
  Top 0.2: U3.23 42.5,25 42.75,24.75 43.25,24.75 43.5,24.5 43.5,22 R29.1
LINEIN_SENSE
  Top 0.2: LINE_IN.3 15.6,4.9 7.25,13.25 | 7.25,13.25 2.25,13.25 0.75,14.75 0.75,26 1.5,26.75 U7.101 | R22.1 7.25,13.25
LNA_EN  (via drill 0.4)
  Top 0.2: U2.6 41.33,63.42 v42,62.75 | v34.25,50.5 34.5,50.5 34.75,50.75 U1.38
  Bottom 0.2: v42,62.75 42,61.75 40.5,60.25 37.25,60.25 36.75,59.75 36.75,55.5 35.5,54.25 35.5,51.75 v34.25,50.5
MCLK  (via drill 0.38, 0.4)
  Top 0.2: v44.25,37.5 44.25,35.23 U3.1
  Bottom 0.2: L5.1 v44.25,37.5
  other vias: 44.25,44
MISO  (via drill 0.38)
  Top 0.2: U1.6 38.75,45 39.5,44.25 v40.25,44.25 | U3.11 36,32.25 v35,31.25 | U7.108 4.35,22.4 v4.5,22.25 | MICROSD.DAT0 v4.5,63.74 | TO_AUX1.3 v30.5,98.5 | v28.5,87.25 26.75,87.25 26.25,86.75 26.25,85.29 CCD.10 26.25,85.21 v26.25,82.5
  Bottom 0.2: v30.5,98.5 30.5,89.25 v28.5,87.25 | v26.25,82.5 26.25,74 21.5,69.25 10.5,69.25 5,63.74 v4.5,63.74 v4.5,22.25 4.5,20 5.75,18.75 19,18.75 31.5,31.25 v35,31.25 36.5,32.75 36.5,34 37.25,34.75 38.25,34.75 39,35.5 39,37.75 40.25,39 v40.25,44.25
MOSI  (via drill 0.38)
  Top 0.2: U1.5 38.25,44.5 v39.25,43.5 | U3.10 35.25,32.75 v35,32.5 | U7.109 6.25,19.75 v6.5,19.5 | MICROSD.CMD 6.41,59.34 v6.5,59.25 | v27.5,85.25 27.5,85.27 CCD.8
  Top 0.5: TO_AUX1.5 v28.5,98.5
  Bottom 0.2: v39.25,43.5 39.25,39 38.5,38.25 38.5,35.75 38,35.25 37,35.25 36,34.25 36,33.25 35.25,32.5 v35,32.5 31.75,32.5 18.75,19.5 v6.5,19.5 v6.5,59.25 6.5,63.5 11.25,68.25 21.75,68.25 27.5,74 v27.5,85.25 27.5,88 29.75,90.25 29.75,97.25 v28.5,98.5
N$1
  Top 0.2: U1.21 41.25,55 42.5,56.25 43,56.25 43.5,56.75 44.5,56.75 44.75,57 44.75,59.5 44.9,59.65 X1.1 46,59.75 46.15,59.6 46.1,59.6 | C29.1 46.25,59.75 46.1,59.6 | 46.1,59.6 46,59.5
N$2
  Top 0.2: U1.22 40.25,55.75 40.5,56 41.5,56 42.1,56.6 X1.3 43.85,57.35 44.25,57.75 44.25,60.5 45,61.25 C24.1
N$3
  Top 0.2: U1.11 41.5,49.5 42.25,48.75 L4.1
N$4
  Top 0.2: U1.16 46,52.25 47.25,51 L11.2
N$5
  Top 0.2: U1.14 44.5,51.25 45.25,50.5 L6.2
N$6
  Top 0.2: C56.1 30.5,37 X3.X1 30.25,37.25 30.25,38 30,38.25 27.75,38.25 27.5,38.5 27.5,40 27.25,40.25 U7.35
N$7
  Top 0.254: U2.15 36.08,63.42 35.25,64.25 31.75,64.25 R8.2
N$8
  Top 0.254: U2.7 42.53,64.08 R9.1
N$9
  Top 0.46: C26.2 arc-90 40.5,87.25 SMA.SIG
N$10
  Bottom 0.2: U8.31 85.75,86.5 85.5,86.25 84.25,86.25 84,86 C55.2 82.75,85.25 R26.1
N$11
  Bottom 0.2: C55.1 86.25,85.25 86.55,85.55 U8.30
N$12
  Top 0.3: AVR.A R44.1
N$13
  Top 0.46: U2.11 38.38,67.03 L7.1
N$14
  Top 0.46: L7.2 C27.1 L8.1
N$15
  Top 0.46: L8.2 C25.1
N$16
  Top 0.46: C25.2 C28.1 37.75,81.25 | 37.75,81.25 C26.1 | 37.75,81.25 37.6,81.1 L10.2
N$17
  Top 0.254: U3.24 42.98,29.02 43.5,28.5 C48.1
N$18
  Top 0.2: U1.36 34.85,51.75 34.25,52.35 L12.1
N$19
  Top 0.2: U1.30 35.25,55 34.1,56.15 R4.2
N$21
  Top 0.2: C23.1 33.25,48.5 33.25,49.25 33.5,49.5 34.25,49.5 35,50.25 U1.39
N$22
  Top 0.5: U5.1 13.45,78.2 13.4,79.65 F1.2
N$23
  Top 0.2: U1.13 43.75,50.75 44.25,50.25 L5.2
N$24
  Top 0.2: R7.1 42.75,54.75 42.5,54.5 42.5,54 42.25,53.75 U1.19
N$25
  Top 0.2: U1.15 45.25,51.75 46.25,50.75 L9.2
N$26
  Top 0.2: U9.1 45.16,16.34 C33.1
N$27
  Top 0.2: U1.17 47,52.75 48.25,51.5 L13.2
N$28  (via drill 0.38)
  Top 0.3: U1.9 40.25,46.5 v40,46
  Bottom 0.3: v40,46 41.5,44.25 41.5,37.5 43.5,35.5 R5.1
  other vias: 46.5,35.5
N$29
  Top 0.3: R5.2 47.75,37.5 CC8531.C
N$30
  Bottom 0.2: U8.9 82.5,95.25 C58.2 R33.1
N$31  (via drill 0.4)
  Bottom 0.3: R3.1 POWER.A
  other vias: 18.5,95.5 18.5,98.75
N$32  (via drill 0.38)
  Top 0.3: CHARGE.C v1.25,70.25 | v7.75,73.75 6.55,73.75 U6.7
  Bottom 0.3: v1.25,70.25 3.5,70.25 4.25,69.5 7.5,69.5 8.75,70.75 8.75,72.75 v7.75,73.75
N$33
  Top 0.2: CHARGE.A 1.25,74.5 R18.1
N$34
  Top 0.2: U3.14 37.75,30.75 37.25,30.25 C37.2
N$35
  Top 0.2: C38.2 35.25,30 35.75,30.5 36.75,30.5 37.5,31.25 U3.13
N$36
  Top 0.3: U6.12 4.5,77.5 4,78 3.75,78 3.5,78.25 3.5,81 L17.1
N$37
  Top 0.2: R21.2 6,73.25 U6.6 U6.5
N$38
  Top 0.2: U6.2 4,73.25 3.5,72.75 3.5,71.75 R20.2
  Top 0.3: R20.2 R19.2
N$40
  Top 0.2: U9.5 38.41,20.16 R15.1
  Top 0.5: 38.41,20.16 41.34,20.16 41.75,19.75 41.75,15.25 42.5,14.5 47.5,14.5 48.5,13.5 48.5,10.9 C39.1
N$41
  Bottom 0.2: U8.11 86.55,96.2 86,96.75 84.75,96.75 84.5,97 C59.2 84.25,98.25 84.25,98.5 83.75,99 81.5,99 81,98.5 R34.1
N$42
  Bottom 0.2: U8.13 88.15,97.85 C60.2 R35.1
N$43
  Top 0.2: R28.2 36,23.75 35,22.75 35,19 34.75,18.75 R27.2 R13.2
N$44  (via drill 0.4)
  Top 0.2: v82.25,88.25 82.25,80.25 SW1.P$1
  Bottom 0.2: R26.2 v82.25,88.25
N$45
  Top 0.2: R29.2 46.75,21.75 R30.2 47.75,20.75 R16.2
N$48
  Top 0.3: R19.1 C54.1
N$49  (via drill 0.38, 0.4)
  Top 0.2: U6.3 4.5,73 v4.75,72.75
  Top 0.3: Q1.3 10.15,75.65 11,76.5 11,78.9 10.8,79.45 F1.1 | U6.10 v5.5,81.5
  Top 0.5: L17.2 7,79.5 7.5,79 C52.1 10.35,79 10.8,79.45
  Bottom 0.2: v4.75,72.75 4.75,75.25 5.5,76 5.5,78 6.5,79 C52.1
  Bottom 0.3: v5.5,81.5 L17.2
  other vias: 8.5,79 7,81.5
N$50
  Top 0.2: EXT.1 CCD.9
N$51
  Top 0.2: U6.8 8.65,76.7 Q1.1
N$53
  Top 0.2: R13.1 R12.2 36.84,16.34 U9.8
N$54
  Top 0.2: R16.1 45.34,20.16 U9.4 43.52,20.25 42.75,20.25 42,21 R15.2
N$55
  Top 0.2: U9.3 44.62,18.89 R31.1
N$56  (via drill 0.4)
  Top 0.5: v94.25,71 v71.75,71
  Bottom 0.5: Q2.3 84,1.75 82.5,3.25 82.5,13.5 80.75,15.25 72.5,15.5 71.75,16.25 v71.75,71 71.75,86 70.75,85.65 LED_UL.1-2 72,87 LED_UL.1 | LED_UR.1 117,89.85 117.1,89.85 117.1,89.95 LED_UR.1-2 118,92.75 117.25,93.5 109.5,93.5 108.25,92.25 108.25,72.25 107,71 v94.25,71
N$58  (via drill 0.4)
  Top 0.5: v95,69.75 v72.75,69.75
  Bottom 0.5: Q3.3 84.25,5 83.5,5.75 83.5,14.25 81.5,16.25 73.5,16.25 72.75,17 v72.75,69.75 72.75,82.4 LED_UL.4-2 76,87.9 LED_UL.4 | v95,69.75 108,69.75 109.75,71.5 109.75,90 110.6,90.85 LED_UR.4-2 114,89.85 LED_UR.4
N$59
  Top 0.2: X3.X2 28.5,39.5 C30.1 28,40.75 U7.36
N$60
  Bottom 0.2: U8.8 81.8,94.05 C58.1
N$61  (via drill 0.4)
  Top 0.2: SW4.P$1 75,60 71,64 71,88.75 R33.2
  other vias: 78.25,96
N$62
  Bottom 0.2: U8.10 85.75,96 85.5,96.25 83.25,96.25 82.5,97 C59.1
N$63  (via drill 0.4)
  Top 0.2: SW5.P$1 72.25,40 70.5,41.75 70.5,89.5 R34.2
  other vias: 79,98
N$64
  Bottom 0.2: U8.12 87.35,96.4 86.5,97.25 86.25,97.25 86,97.5 C60.1
N$65  (via drill 0.4)
  Top 0.2: SW6.P$1 113.5,20 118.25,24.75 118.25,90.5 111.75,97 92.5,97 R35.2
  other vias: 91.5,98
N$66
  Bottom 0.2: U8.25 91.25,87.25 C66.2 92.25,85.5 92.5,85.25 R39.1
N$67  (via drill 0.4)
  Top 0.5: TO_AUX2.1 22.4,12.9 L19.1 | TO_AUX2.2 27.65,12.6 C57.1
  Bottom 0.5: L19.1 C57.1
  other vias: 22.5,12.75 27.5,12.75
N$68
  Bottom 0.2: U8.27 88.95,85.3 C67.2 89,84.5 89.25,84.25 R40.1
N$69
  Bottom 0.2: U8.24 92.05,88.45 C66.1
N$70  (via drill 0.4)
  Top 0.2: SW9.P$1 102.75,80 R39.2
  other vias: 97.5,85.25
N$71
  Bottom 0.2: R37.1 C61.2 95,91.75 94.5,91.75 93.8,92.45 U8.19
N$72  (via drill 0.4)
  Top 0.2: SW7.P$1 113.75,40 117.5,43.75 117.5,89 115,91.5 R37.2
  other vias: 98.5,91.5
N$73
  Bottom 0.2: U8.22 94.2,90.05 C62.2 R38.1
N$74  (via drill 0.4)
  Top 0.2: SW8.P$1 109.25,60 116.75,67.5 116.75,85.5 113.5,88.75 97.5,88.75 R38.2
  other vias: 96.5,87.75
N$75
  Bottom 0.2: U8.23 93,89.25 C62.1
N$76
  Bottom 0.2: U8.20 93.1,91.65 C61.1
N$77
  Bottom 0.2: U8.29 87.35,86.15 R36.1
N$78  (via drill 0.4)
  Top 0.5: v95.75,68.5 v73.75,68.5
  Bottom 0.5: Q4.3 85.25,8.25 84.5,9 84.5,15 82.25,17.25 74.5,17.25 73.75,18 v73.75,68.5 73.75,79.25 79.5,85 79.5,90 79,90.5 77.1,90.5 LED_UL.3-2 76,89.6 LED_UL.3 | LED_UR.3 114,88.15 LED_UR.3-2 113,70 111.5,68.5 v95.75,68.5
N$79  (via drill 0.4)
  Top 0.5: v103.5,8.25 72.75,8.25 v72,7.5
  Bottom 0.5: LED_LR.1 117,10.85 LED_LR.1-2 118,14 117.25,14.75 104,14.75 102.1,12.85 Q5.3 v103.5,8.25 | LED_LL.1 72,8.25 LED_LL.1-2 v72,7.5
N$80  (via drill 0.4)
  Top 0.5: v79.25,5 v103.5,5
  Bottom 0.5: Q6.3 v103.5,5 104.5,5 107.5,5 109.25,6.75 109.25,10.5 110.6,11.85 LED_LR.4-2 114,10.85 LED_LR.4 | LED_LL.4 76,9.15 LED_LL.4-2 77,7.25 v79.25,5
N$81
  Bottom 0.2: U8.26 89.75,86.5 C67.1
N$82  (via drill 0.4)
  Top 0.2: SW10.P$1 88.5,20 98,29.5 98,80.5 R40.2
  other vias: 94.25,84.25
N$83  (via drill 0.4)
  Top 0.5: v81.5,1.75 v103.75,1.75
  Bottom 0.5: Q7.3 v103.75,1.75 111.25,1.75 113,3.5 LED_LR.3-2 114,9.15 LED_LR.3 | v81.5,1.75 81,2.25 81,10.75 79.9,11.85 LED_LL.3-2 76,10.85 LED_LL.3
N$84
  Top 0.5: TO_AUX1.4 TO_AUX1.2 34.4,93.35 L18.1 C65.1
N$85
  Top 0.2: U7.43 20.75,45 R41.1
N$86
  Top 0.2: U7.42 R42.1
N$87
  Top 0.2: U7.40 22.25,41.5 22.5,41.25 24,41.25 25,42.25 R32.2 C68.1
N$90
  Top 0.2: U7.53 15.75,43.75 16.75,44.75 R43.2
OUT_L
  Top 0.2: PHONE_OUT.4 42.75,10.5 R25.2
  Top 0.5: C36.2 43.8,8.75 PHONE_OUT.4
OUT_R  (via drill 0.38)
  Top 0.5: 45.85,11.15 C39.2 45.85,11.4 46.5,10.75 46.5,7.25 46,6.75 v37,6.75 | v34.75,6.75 33.4,6.75 PHONE_OUT.1
  Bottom 0.5: v37,6.75 v34.75,6.75
PA_EN  (via drill 0.4)
  Top 0.2: v40.75,62 40.75,62.62 U2.5 | R10.2 L12.2
  Bottom 0.2: R10.2 33,52.5 33.25,52.75 33.25,57.5 34.25,58.5 34.25,60.5 34.5,60.75 40.25,60.75 40.75,61.25 v40.75,62
  other vias: 30.75,52.5
PHONE_L
  Top 0.2: U3.25 43.75,29.75 44.5,29 R28.1
PHONE_R
  Top 0.2: U3.27 48,30.75 48.5,30.25 48.5,24.5 R30.1
PHONE_SENSE
  Top 0.2: PHONE_OUT.3 37.35,4.9 35.75,6.5 R24.1 35.75,14 35.5,14.25 29.5,14.25 29,14.75 29,16.75 26,19.75 22,19.75 21.75,20 U7.140
RED_BOT
  Top 0.2: TO_AUX2.4 26.5,9 26,9.5 26,17.75 25,18.75 22,18.75 21.25,19.5 U7.139
RED_TOP
  Top 0.2: TO_AUX2.7 21.25,5 20.5,5.75 20.5,14.75 17.75,17.5 U7.132
REF
  Top 0.254: U3.18 40,27.75 C50.1
RESET_CC8531  (via drill 0.38)
  Top 0.2: L4.2 40.25,42.5 37.25,39.5 v35.5,39.5 35,39.5 33.75,38.25 33.75,34.25 32.25,32.75 U7.20 | CCD.7 27.48,90.77 27,91.25 22,91.25 21.5,90.75 21.5,86.25 24.25,83.5 24.25,49.5 26.5,47.25 27.75,47.25 29,46 29,43.25 29.5,42.75 32.5,42.75 v34,41.25
  Bottom 0.2: v34,41.25 v35.5,39.5
RESET_CODEC  (via drill 0.38)
  Top 0.2: U7.16 31,30.75 34.25,34 v37.5,34 | v44.75,34 44.75,33.25 44.25,32.75 U3.31
  Bottom 0.2: v37.5,34 v44.75,34
RF_N
  Top 0.2: 38.38,60.62 38.75,60.25 U1.25
  Top 0.254: U2.2 38.38,60.62
RF_P
  Top 0.2: 39.67,60.67 39.25,60.25 U1.24
  Top 0.254: U2.4 39.67,60.67
SCLK  (via drill 0.38)
  Top 0.2: U1.4 37.75,43.25 v38.25,42.75 | U7.110 6.75,23 7.25,23.5 v8.25,23.5 | MICROSD.CLK 7.96,61.55 v8.25,61.25 | TO_AUX1.1 v32.5,98.5 | v30,87.25 29.5,87.25 28.75,86.5 CCD.6 v28.75,82.5 | U3.8 39.02,33.98 38.5,34.5 38.5,39 v38.25,39.25
  Bottom 0.2: v38.25,42.75 v38.25,39.25 37.25,39.25 36.5,38.5 36.5,35.5 35.5,34.5 35.5,34 34.75,33.25 24.5,33.25 23,31.75 23,25 21.5,23.5 v8.25,23.5 v8.25,61.25 13.5,66.5 21.75,66.5 28.75,73.5 v28.75,82.5 | v32.5,98.5 32.5,88.25 31.5,87.25 v30,87.25
USBOTGID  (via drill 0.38)
  Top 0.2: USB2.4 10.35,94.85 10,94.5 10,93.5 17,86.5 17,55.25 19,53.25 20.5,53.25 21.25,52.5 v21.25,49 | v16.25,24.25 U7.129
  Bottom 0.2: v21.25,49 21.25,27.5 18.25,24.5 16.5,24.5 v16.25,24.25
VBUS  (via drill 0.4)
  Top 0.2: U7.39 22.75,44 v22.5,44.25 | 6.25,94.75 7.75,94.75 15.5,87 15.5,53.75 17.25,52 v20.5,52 | R18.2 1.25,76.75 2,77.5 3.75,77.5 4,77.25 U6.13
  Top 0.3: USB1.1 40.4,95.65 40.5,95.75 | R18.2 1,84 | 4.5,83.5 4.75,83.25 4.75,79 C51.1 5,78.25 U6.11
  Top 0.4: USB2.1 12.35,95.65
  Top 0.5: 12.35,95.65 12.9,95.65 13.25,96 13.25,97 | 4.5,83.5 1.5,83.5 1,84 0.5,84.5 0.5,92.75 1.5,93.75 5.25,93.75 6.25,94.75 6.25,96.25 7,97 13.25,97 | 40.5,95.75 40.5,96.5 40,97 13.25,97
  Bottom 0.2: v22.5,44.25 22.5,50 v20.5,52
VDDCORE
  Top 0.2: 14.25,39.75 U7.56 14.25,44 C44.1 14,45.75 14,47.75 C43.1 | U7.124 13.75,25.25 | 13.75,25.25 13.75,27.75 | 13.75,27.75 13.75,39.75 | U7.104 13.75,25.25 | U7.10 13.75,27.75 | U7.34 19.75,39.75 | 19.75,39.75 14.25,39.75 | 14.25,39.75 13.75,39.75 | U7.45 19.75,39.75 | U7.61 11.75,40.25 12.25,39.75 13.75,39.75
WCLK  (via drill 0.38, 0.4)
  Top 0.2: U3.3 42,38.75 42.75,39.5 v46.25,39.5
  Bottom 0.2: v46.25,39.5 L9.1
  other vias: 46.25,44

## Text on the board
tPlace: Eva Kloiber | Use RP-SMA (M) | antenna | Feb 2013 | open | hardware
tDocu: 2.40mm | AVDD_LNA | 6.90mm | AVDD_PA2 | 1.85mm | AVDD_PA1 | 4-layer 1.6mm | PCB designed for | stackup: FR-4 | with 2 x 2116 | 1oz copper | prepreg and